# Altium schematic sheet iCliQ_v1.SchDoc
size 431 x 279 mm; Organization: ORGANIZATION; Address1: ADDRESS 1; Address2: ADDRESS 2; Address3: ADDRESS 3; Address4: ADDRESS 4; Revision: -; SheetNumber: 1; SheetTotal: 1; ENG_APP_DATE: --/--/--; DSN_APP_DATE: --/--/--; CHK_APP_DATE: --/--/--
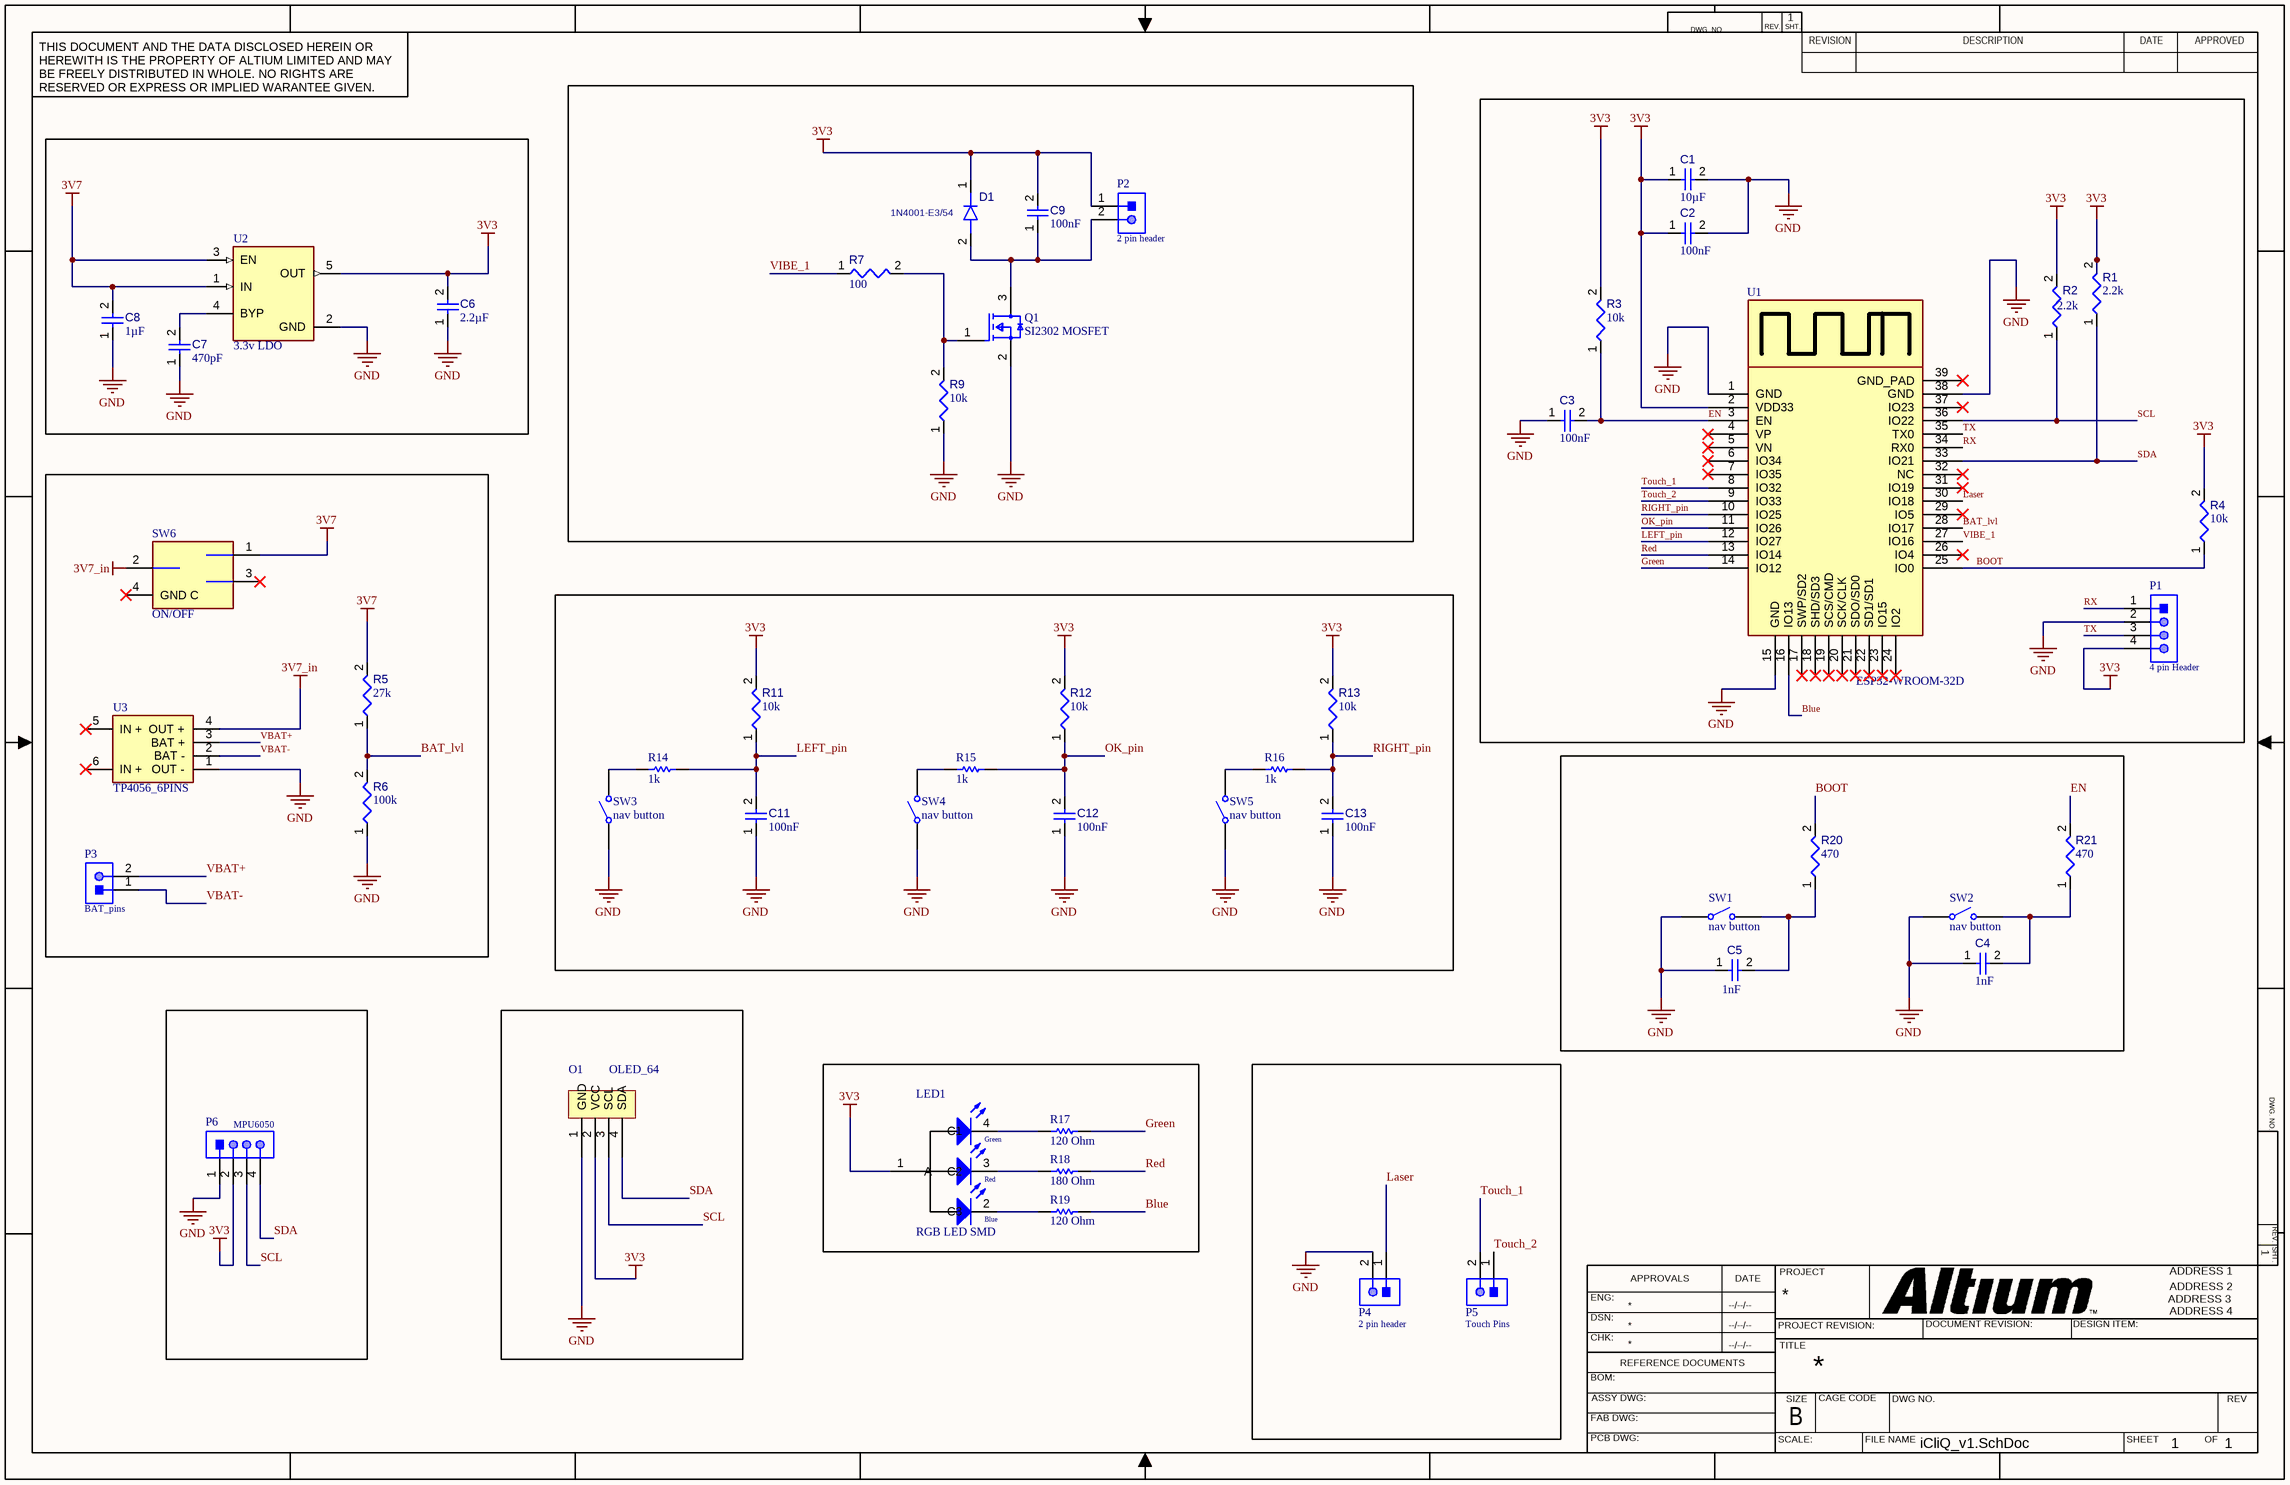
[diagram p0: iCliQ_v1.SchDoc]

## Parts
C1  value 10µF  [FP-C0805C-DG-IPC_A]  (hidden comment: 10uF 10V 0805)
C2  value 100nF  [CAPC2013X95X50LL10T25]  (hidden comment: Capacitor 100 nF +/-10% 50 V 0805)
C3  value 100nF  [CAPC2013X95X50LL10T25]  (hidden comment: Capacitor 100 nF +/-10% 50 V 0805)
C4  value 1nF  [FP-C0805C-DN-IPC_A]  (hidden comment: 1 nF 50V 0805)
C5  value 1nF  [FP-C0805C-DN-IPC_A]  (hidden comment: 1 nF 50V 0805)
C6  value 2.2µF  [FP-C0805C225K4RACAUTO-IPC_A]  (hidden comment: 2.2 uF 0805)
C7  value 470pF  [FP-C0805C-DN-IPC_A]  (hidden comment: 470 pF 0805)
C8  value 1µF  [CAPC2013X140X50LL20T25]  (hidden comment: 1uF 10V 0805)
C9  value 100nF  [CAPC2013X95X50LL10T25]  (hidden comment: Capacitor 100 nF +/-10% 50 V 0805)
C11  value 100nF  [CAPC2013X95X50LL10T25]  (hidden comment: Capacitor 100 nF +/-10% 50 V 0805)
C12  value 100nF  [CAPC2013X95X50LL10T25]  (hidden comment: Capacitor 100 nF +/-10% 50 V 0805)
C13  value 100nF  [CAPC2013X95X50LL10T25]  (hidden comment: Capacitor 100 nF +/-10% 50 V 0805)
D1  1N4001-E3/54  [FP-1N4001-E3-54-MFG]
LED1  RGB LED SMD  [3528_A]
O1  OLED_64  [OLED_SSD1306_64]
P1  4 pin Header  [61300411121]
P2  2 pin header  [61300211121]
P3  BAT_pins  [61300211121]
P4  2 pin header  [61300211121]
P5  Touch Pins  [61300211121]
P6  MPU6050  [61300411121]
Q1  SI2302 MOSFET  [FP-S-03946-MFG]
R1  value 2.2k  [RESC2013X60X40LL20T25]  (hidden comment: 2.2K 0805)
R2  value 2.2k  [RESC2013X60X40LL20T25]  (hidden comment: 2.2K 0805)
R3  value 10k  [RESC2013X60X35LL10T20]  (hidden comment: 10K 0805)
R4  value 10k  [RESC2013X60X35LL10T20]  (hidden comment: 10K 0805)
R5  value 27k  [RESC2013X60X40LL20T25]  (hidden comment: 27K 0805)
R6  value 100k  [RESC2013X70X40ML20T20]  (hidden comment: Resistor 100k +/-1% 0805 125 mW)
R7  value 100  [RESC2013X60X40LL20T25]  (hidden comment: 100 Ohm 0805)
R9  value 10k  [RESC2013X60X35LL10T20]  (hidden comment: 10K 0805)
R11  value 10k  [RESC2013X60X35LL10T20]  (hidden comment: 10K 0805)
R12  value 10k  [RESC2013X60X35LL10T20]  (hidden comment: 10K 0805)
R13  value 10k  [RESC2013X60X35LL10T20]  (hidden comment: 10K 0805)
R14  value 1k  [RESC2013X70X40NL20T20]  (hidden comment: Resistor 1K +/-5% 0805 500 mW.)
R15  value 1k  [RESC2013X70X40NL20T20]  (hidden comment: Resistor 1K +/-5% 0805 500 mW.)
R16  value 1k  [RESC2013X70X40NL20T20]  (hidden comment: Resistor 1K +/-5% 0805 500 mW.)
R17  value 120 Ohm  [RESC2013X50X35ML15T15]  (hidden comment: Resistor 0R +/- 1% 0805 125 mW)
R18  value 180 Ohm  [RESC2013X50X35ML15T15]  (hidden comment: Resistor 0R +/- 1% 0805 125 mW)
R19  value 120 Ohm  [RESC2013X50X35ML15T15]  (hidden comment: Resistor 0R +/- 1% 0805 125 mW)
R20  value 470  [RESC0805(2012)_L]  (hidden comment: Resistor 470R +/-5% 0805 125 mW)
R21  value 470  [RESC0805(2012)_L]  (hidden comment: Resistor 470R +/-5% 0805 125 mW)
SW1  nav button  [434121050816]
SW2  nav button  [434121050816]
SW3  nav button  [434121050816]
SW4  nav button  [434121050816]
SW5  nav button  [434121050816]
SW6  Part Number: ON/OFF  [ALPS_SSSS811101_0]  (hidden comment: Switch_ALPS_SSSS811101_eec)
U1  ESP32-WROOM-32D  [ESP32-WROOM-32D]
U2  3.3v LDO  [FP-SOT23-5LD-PL-1-MFG]
U3  TP4056_6PINS  [TP4056_6PINs]

## Nets
3V3: C1.1 C2.1 C6.2 C9.2 D1.1(K) LED1.1(A) O1.2(VCC) P1.4 P2.1 P6.2 R1.2 R2.2 R3.2 R4.2 R11.2 R12.2 R13.2 U1.2(VDD33) U2.5(OUT)
3V7: C8.2 R5.2 SW6.1 U2.1(IN) U2.3(EN)
3V7_in: SW6.2(C) U3.4(OUT_+)
GND: C1.2 C2.2 C3.1 C4.1 C5.1 C6.1 C7.1 C8.1 C11.1 C12.1 C13.1 O1.1(GND) P1.2 P4.2 P6.1 Q1.2(S) R6.1 R9.1 SW1.1 SW2.1 SW3.1 SW4.1 SW5.1 U1.1(GND) U1.15(GND) U1.38(GND) U2.2(GND) U3.1(OUT_-)
BAT_lvl: R5.1 R6.2 U1.28(IO17)
Blue: R19.2 U1.16(IO13)
BOOT: R4.1 R20.2 U1.25(IO0)
EN: C3.2 R3.1 R21.2 U1.3(EN)
Green: R17.2 U1.14(IO12)
Laser: P4.1 U1.30(IO18)
LEFT_pin: C11.2 R11.1 R14.2 U1.12(IO27)
OK_pin: C12.2 R12.1 R15.2 U1.11(IO26)
Red: R18.2 U1.13(IO14)
RIGHT_pin: C13.2 R13.1 R16.2 U1.10(IO25)
RX: P1.1 U1.34(RX0)
SCL: O1.3(SCL) P6.3 R2.1 U1.36(IO22)
SDA: O1.4(SDA) P6.4 R1.1 U1.33(IO21)
Touch_1: P5.2 U1.8(IO32)
Touch_2: P5.1 U1.9(IO33)
TX: P1.3 U1.35(TX0)
VBAT+: P3.2 U3.3(BAT_+)
VBAT-: P3.1 U3.2(BAT_-)
VIBE_1: R7.1 U1.27(IO16)
NetC4_2: C4.2 R21.1 SW2.2
NetC5_2: C5.2 R20.1 SW1.2
NetC7_2: C7.2 U2.4(BYP)
NetC9_1: C9.1 D1.2(A) P2.2 Q1.3(D)
NetLED1_2: LED1.2(C3) R19.1
NetLED1_3: LED1.3(C2) R18.1
NetLED1_4: LED1.4(C1) R17.1
NetQ1_1: Q1.1(G) R7.2 R9.2
NetR14_1: R14.1 SW3.2
NetR15_1: R15.1 SW4.2
NetR16_1: R16.1 SW5.2

Not connected (* = marked no-connect by the designer): SW6 3* 4(GND_C)*; U1 4(VP)* 5(VN)* 6(IO34)* 7(IO35)* 17(SWP/SD2)* 18(SHD/SD3)* 19(SCS/CMD)* 20(SCK/CLK)* 21(SDO/SD0)* 22(SD1/SD1)* 23(IO15)* 24(IO2)* 26(IO4)* 29(IO5)* 31(IO19)* 32(NC)* 37(IO23)* 39(GND_PAD)*; U3 5(IN_+)* 6(IN_+)*

## Notes on the sheet
- DWG. NO.
- REV.
- SHT.
- THIS DOCUMENT AND THE DATA DISCLOSED HEREIN OR HEREWITH IS THE PROPERTY OF ALTIUM LIMITED AND MAY BE FREELY DISTRIBUTED IN WHOLE. NO RIGHTS ARE RESERVED OR EXPRESS OR IMPLIED WARANTEE GIVEN.
- REVISION
- DESCRIPTION
- DATE
- APPROVED
- ENG:
- APPROVALS
- PROJECT
- DSN:
- CHK:
- REFERENCE DOCUMENTS
- PROJECT REVISION:
- TITLE
- DOCUMENT REVISION:
- DESIGN ITEM:
- BOM:
- FAB DWG:
- PCB DWG:
- ASSY DWG:
- SCALE:
- SIZE
- B
- CAGE CODE
- FILE NAME
- DWG NO.
- SHEET
- OF
- REV
- (in symbol CMP-00030-00002-1) Green; Red; Blue

## Library data of the parts
C1 = CMP-001-00085-1: Ceramic Capacitor, Multilayer, Ceramic, 10V, 10% +Tol, 10% -Tol, X5R, 15% TC, 10uF, Surface Mount, 0805; Min Operating Temperature: -55°C; Case/Package: 0805; Max Operating Temperature: 85°C; Capacitor Type: Ceramic; Pins: 2; RoHS Compliant: Yes; Mounting Technology: Surface Mount
C2 C3 C9 C11-C13 = CMP-001-00018-6: Chip Capacitor, 100 nF, +/- 10%, 50 V, 0805 (2012 Metric); Capacitor Type: Ceramic; Voltage Rating: 50V; Pins: 2; Max Operating Temperature: 125°C; Min Operating Temperature: -55°C; Mounting Technology: SM; Case/Package: 0805; RoHS Compliant: True; Tolerance: 10%
C4 C5 = CMP-001-00087-1: Ceramic Capacitor, Multilayer, Ceramic, 50V, 5% +Tol, 5% -Tol, C0G, 30ppm/Cel TC, 0.001uF, Surface Mount, 0805; Mounting Technology: Surface Mount; RoHS Compliant: Yes; Pins: 2; Min Operating Temperature: -55°C; Case/Package: 0805; Max Operating Temperature: 125°C; Capacitor Type: Ceramic
C6 = CMP-001-00091-1: Ceramic Capacitor, Multilayer, Ceramic, 16V, 10% +Tol, 10% -Tol, X7R, 15% TC, 2.2uF, Surface Mount, 0805; Case/Package: 0805; Capacitor Type: Ceramic; Min Operating Temperature: -55°C; Mounting Technology: Surface Mount; Pins: 2; RoHS Compliant: Yes; Max Operating Temperature: 125°C
C7 = CMP-001-00088-1: Ceramic Capacitor, Multilayer, Ceramic, 50V, 10% +Tol, 10% -Tol, X7R, 15% TC, 0.00047uF, Surface Mount, 0805; Min Operating Temperature: -55°C; Case/Package: 0805; Pins: 2; Max Operating Temperature: 125°C; RoHS Compliant: Yes; Mounting Technology: Surface Mount; Capacitor Type: Ceramic
C8 = CMP-001-00086-1: Ceramic Capacitor, Multilayer, Ceramic, 10V, 5% +Tol, 5% -Tol, X8L, 15% TC, 1uF, Surface Mount, 0805; Pins: 2; Capacitor Type: Ceramic; Mounting Technology: Surface Mount; RoHS Compliant: Yes; Min Operating Temperature: -55°C; Case/Package: 0805; Max Operating Temperature: 150°C
D1 = CMP-004-00031-1: Rectifier Diode, 1 Phase, 1 Element, 1A, 50V V(RRM), Silicon, DO-204AL; Forward Voltage: 1.1V; Max Operating Temperature: 150°C; Pins: 2; RoHS Compliant: Yes; Min Operating Temperature: -50°C
LED1 = CMP-00030-00002-1: Triple Color LED, Red/green/blue, Water Clear; RoHS Compliant: Yes
O1 = OLED_64: JST (JAPAN SOLDERLESS TERMINALS) - B8B-XH-A (LF)(SN) - HEADER, VERTICAL, 8WAY; No of Positions: 8; Pitch: 2.5 mm; Style/Orientation: Straight Header/Plug; Supplier 1: Digi-Key; Manufacturer: JST; Manufacturer Part Number: B8B-XH-A(LF)(SN); Stock 1: 29643; Pricing 1: 1=0.36, 10=0.341, 100=0.2387, 500=0.2046, 1000=0.1705, 5000=0.1461, 10000=0.1364 (USD); Type: Shrouded Header; Termination: Crimp; ComponentLink1URL: https://www.verical.com/server-webapp/html/getDatasheet?partID=440408&src-supplier=Verical; ComponentLink1Description: https://www.verical.com/server-webapp/html/getDatasheet?partID=440408&src-supplier=Verical; Supplier Part Number 1: 455-2251-ND
P1 P6 = CMP-002-00078-1: Board Connector, 4 Contact(s), 1 Row(s), Male, Straight, 0.1 inch Pitch, Solder Terminal, Locking, Black Insulator, Plug; Connector Type: BOARD CONNECTOR; Min Operating Temperature: -40°C; Mounting Technology: Board; Max Operating Temperature: 125°C; RoHS Compliant: Yes
P2-P5 = CMP-002-00075-1: Board Connector, 2 Contact(s), 1 Row(s), Male, Straight, 0.1 inch Pitch, Solder Terminal, Locking, Black Insulator, Plug; Min Operating Temperature: -40°C; Connector Type: BOARD CONNECTOR; Mounting Technology: Board; RoHS Compliant: Yes; Max Operating Temperature: 125°C
Q1 = CMP-011-00017-1: Small Signal Field-Effect Transistor, 2.6A I(D), 20V, 1-Element, N-Channel, Silicon, Metal-oxide Semiconductor FET, TO-236AB; Max Operating Temperature: 150°C; Pins: 3; RoHS Compliant: Yes
R1 R2 = CMP-009-00187-1: Fixed Resistor, Thin Film, 0.125W, 2200ohm, 100V, 0.5% +/-Tol, 25ppm/Cel, Surface Mount, 0805; Power: 125mW; Mounting Technology: Surface Mount; Max Operating Temperature: 155°C; Pins: 2; Min Operating Temperature: -55°C; Tolerance: 0.5%; RoHS Compliant: Yes; Case/Package: 0805
R3 R4 R11-R13 = CMP-009-00180-1: Fixed Resistor, Metal Glaze/thick Film, 0.125W, 10000ohm, 150V, 1% +/-Tol, 100ppm/Cel, Surface Mount, 0805; Power: 125mW; Max Operating Temperature: 155°C; Tolerance: 1%; Min Operating Temperature: -55°C; Mounting Technology: Surface Mount; RoHS Compliant: Yes; Case/Package: 0805; Pins: 2
R5 = CMP-009-00191-1: Fixed Resistor, Thin Film, 0.125W, 27000ohm, 100V, 0.1% +/-Tol, 25ppm/Cel, Surface Mount, 0805; Power: 125mW; Mounting Technology: Surface Mount; Max Operating Temperature: 155°C; Min Operating Temperature: -55°C; Case/Package: 0805; Tolerance: 0.1%; RoHS Compliant: Yes; Pins: 2
R6 = CMP-009-00024-5: Chip Resistor, 100 KOhm, +/- 1%, 0.125 W, -55 to 155 degC, 0805 (2012 Metric); Power: 125mW; Voltage Rating: 150V; Max Operating Temperature: 155°C; Mounting Technology: SM; RoHS Compliant: True; Tolerance: 1%; Case/Package: 0805; Min Operating Temperature: -55°C; Pins: 2
R7 = CMP-009-00189-1: Fixed Resistor, Thin Film, 0.125W, 100ohm, 100V, 0.1% +/-Tol, 25ppm/Cel, Surface Mount, 0805; Power: 125mW; Min Operating Temperature: -55°C; Pins: 2; Max Operating Temperature: 155°C; RoHS Compliant: Yes; Mounting Technology: Surface Mount; Tolerance: 0.1%; Case/Package: 0805
R9 = CMP-009-00181-1: Fixed Resistor, Metal Glaze/thick Film, 0.125W, 10000ohm, 150V, 1% +/-Tol, 100ppm/Cel, Surface Mount, 0805; Power: 125mW; Tolerance: 1%; Pins: 2; Mounting Technology: Surface Mount; Min Operating Temperature: -55°C; Case/Package: 0805; RoHS Compliant: Yes; Max Operating Temperature: 155°C
R14-R16 = CMP-009-00178-1: Fixed Resistor, Metal Glaze/thick Film, 0.5W, 1000ohm, 400V, 5% +/-Tol, 200ppm/Cel, Surface Mount, 0805; Power: 500mW; Tolerance: 5%; RoHS Compliant: Yes; Max Operating Temperature: 155°C; Case/Package: 0805; Pins: 2; Min Operating Temperature: -55°C; Mounting Technology: Surface Mount
R17-R19 = CMP-009-00001-5: Chip Resistor, 0 Ohm, +/- 1%, 125 mW, -55 to 155 degC, 0805 (2012 Metric); Voltage Rating: 150V; Power: 125mW; Mounting Technology: SM; Max Operating Temperature: 155°C; Case/Package: 0805; RoHS Compliant: True; Pins: 2; Min Operating Temperature: -55°C; Tolerance: 1%
R20 R21 = CMP-009-00122-3: Chip Resistor, 470 Ohms, +/-5%, 125 mW, -55 to 155 degC, 0805; Tolerance: 5%; Power: 125mW; Max Operating Temperature: 155°C; Case/Package: 0805; Pins: 2; Min Operating Temperature: -55°C
SW1-SW5 = CMP-011-00016-1: Keypad Switch, 1 Switches, SPST, Momentary-tactile, 0.05A, 12VDC, 2.06N, Solder Terminal, Surface Mount-straight; RoHS Compliant: Yes; Max Operating Temperature: 85°C; Mounting Technology: Surface Mount; Min Operating Temperature: -40°C
SW6 = Switch_ALPS_SSSS811101_eec: Manufacturer: ALPS; Contact resistance: 70mΩ; Rating (max.)/(min.) (Resistive load): 0.3A 5V DC/50µA 3V DC; helpURL: https://upverter.com/upn/revision/f852cec42ba360d8/; ComponentLink2Description: Datasheet; Temperature: -40°C to +85°C; Package: SMD_SW_SPDT; Supplier 2: Mouser; Supplier 1: Digi-Key; ComponentLink1URL: https://upverter.com/upn/revision/f852cec42ba360d8/; Supplier Part Number 2: 688-SSSS811101; ComponentLink1Description: Upverter; ComponentLink2URL: http://www.alps.com/prod/info/E/HTML/Switch/Slide/SSSS8/SSSS811101.html; RoHS: TRUE; Mouser Part Number: 688-SSSS811101; Temperature Range High: +85°C; Temperature Range Low: -40°C; Lead Free: yes
U1 = CMP-016-000004-1: Chip SMD 39 Pads Wifi 2.4GHz BLE 4.2 18x25.5mm w/ Antenna.; ComponentLink1URL: https://www.mouser.com/datasheet/2/891/esp32_wroom_32d_esp32_wroom_32u_datasheet_en-1365844.pdf; JLCPCB PN: C82899; ComponentLink1Description: Datasheet; Pin Count: 39; Digikey PN: 1965-ESP32-WROOM-32D-N8CT-ND; Component Type: Standard; Mouser PN: ESP32-WROOM-32D-N4; Source: Espressif Microcontrollers.SchLib; Design Item ID: ESP32-WROOM-32D
U2 = CMP-021-000001-1: IC REG LDO 3.3V 0.5A SOT23-5
U3 = CMP-00029-00003-2: MODULE BATTERY CHARGER 6 PINS; Source: Random.SchLib; Component Type: Standard; Design Item ID: TP4056_6PINS; Pins: 6